# Altium schematic sheet [06]J-Link OB Debugger.SchDoc
size A4; Organization: Altium Limited; Address1: L3, 12a Rodborough Rd; Address2: Frenchs Forest; Address3: NSW; Address4: Australia 2086
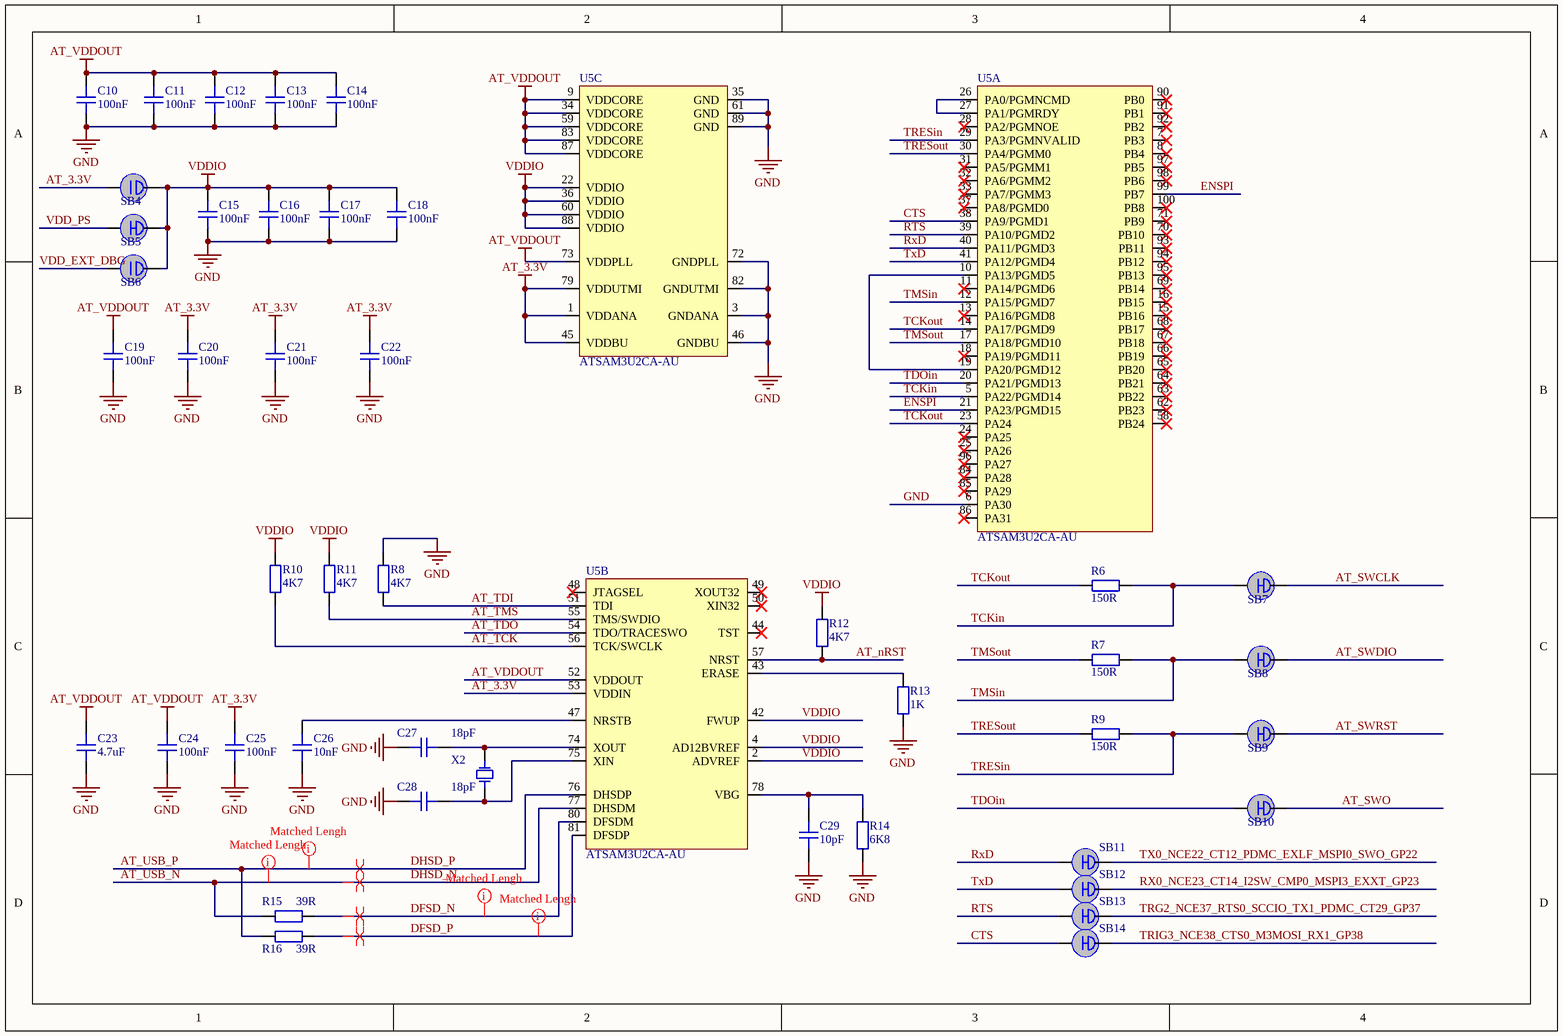
[diagram p0: [06]J-Link OB Debugger.SchDoc]

## Parts
C10  100nF  [CAPC1005L]
C11  100nF  [CAPC1005L]
C12  100nF  [CAPC1005L]
C13  100nF  [CAPC1005L]
C14  100nF  [CAPC1005L]
C15  100nF  [CAPC1005L]
C16  100nF  [CAPC1005L]
C17  100nF  [CAPC1005L]
C18  100nF  [CAPC1005L]
C19  100nF  [CAPC1005L]
C20  100nF  [CAPC1005L]
C21  100nF  [CAPC1005L]
C22  100nF  [CAPC1005L]
C23  4.7uF  [CAPC1005L]
C24  100nF  [CAPC1005L]
C25  100nF  [CAPC1005L]
C26  10nF  [CAPC1005L]
C27  18pF  [CAPC1005L]
C28  18pF  [CAPC1005L]
C29  10pF  [CAPC1005L]
R6  150R  [RESC1005L]
R7  150R  [RESC1005L]
R8  4K7  [RESC1005L]
R9  150R  [RESC1005L]
R10  4K7  [RESC1005L]
R11  4K7  [RESC1005L]
R12  4K7  [RESC1005L]
R13  1K  [RESC1005L]
R14  6K8  [RESC1005L]
R15  39R  [RESC1005L]
R16  39R  [RESC1005L]
SB4  SBO  [SBO]  (value not drawn)  (no BOM)
SB5  SBS  [SBS]  (value not drawn)  (net tie, no BOM)
SB6  SBO  [SBO]  (value not drawn)  (no BOM)
SB7  SBS  [SBS]  (value not drawn)  (net tie, no BOM)
SB8  SBS  [SBS]  (value not drawn)  (net tie, no BOM)
SB9  SBS  [SBS]  (value not drawn)  (net tie, no BOM)
SB10  SBS  [SBS]  (value not drawn)  (net tie, no BOM)
SB11  SBS  [SBS]  (value not drawn)  (net tie, no BOM)
SB12  SBS  [SBS]  (value not drawn)  (net tie, no BOM)
SB13  SBS  [SBS]  (value not drawn)  (net tie, no BOM)
SB14  SBS  [SBS]  (value not drawn)  (net tie, no BOM)
U5  ATSAM3U2CA-AU  [SQFP50P1600X1600-100L]  (parts A,B,C of 3)
X2  7M-12.000MAAJ-T  [OSCCC250X320X100L]  (value not drawn)

## Nets
AT_3.3V: C20.2 C21.2 C22.2 C25.2 SB4.1 U5.1(VDDANA) U5.45(VDDBU) U5.53(VDDIN) U5.79(VDDUTMI)
AT_VDDOUT: C10.2 C11.2 C12.2 C13.2 C14.2 C19.2 C23.2 C24.2 U5.9(VDDCORE) U5.34(VDDCORE) U5.52(VDDOUT) U5.59(VDDCORE) U5.73(VDDPLL) U5.83(VDDCORE) U5.87(VDDCORE)
GND: C10.1 C11.1 C12.1 C13.1 C14.1 C15.1 C16.1 C17.1 C18.1 C19.1 C20.1 C21.1 C22.1 C23.1 C24.1 C25.1 C26.1 C27.2 C28.2 C29.1 R8.2 R13.1 R14.2 U5.3(GNDANA) U5.6(PA30) U5.35(GND) U5.46(GNDBU) U5.61(GND) U5.72(GNDPLL) U5.82(GNDUTMI) U5.89(GND) X2.2 X2.4
VDDIO: C15.2 C16.2 C17.2 C18.2 R10.2 R11.2 R12.1 SB4.2 SB5.2 SB6.2 U5.2(ADVREF) U5.4(AD12BVREF) U5.22(VDDIO) U5.36(VDDIO) U5.42(FWUP) U5.60(VDDIO) U5.88(VDDIO)
AT_nRST: R12.2 U5.57(NRST)
AT_SWCLK: SB7.2
AT_SWDIO: SB8.2
AT_SWO: SB10.2
AT_SWRST: SB9.2
AT_TCK: R10.1 U5.56(TCK/SWCLK)
AT_TDI: R8.1 U5.51(TDI)
AT_TDO: U5.54(TDO/TRACESWO)
AT_TMS: R11.1 U5.55(TMS/SWDIO)
AT_USB_N: R15.2 U5.77(DHSDM)  [also labelled DHSD_N]
AT_USB_P: R16.2 U5.76(DHSDP)  [also labelled DHSD_P]
CTS: SB14.1 U5.38(PA9/PGMD1)
DFSD_N: R15.1 U5.80(DFSDM)
DFSD_P: R16.1 U5.81(DFSDP)
ENSPI: U5.21(PA23/PGMD15) U5.99(PB7)
RTS: SB13.1 U5.39(PA10/PGMD2)
RX0_NCE23_CT14_I2SW_CMP0_MSPI3_EXXT_GP23: SB12.2
RxD: SB11.1 U5.40(PA11/PGMD3)
TCKin: R6.1 SB7.1 U5.5(PA22/PGMD14)
TCKout: R6.2 U5.14(PA17/PGMD9) U5.23(PA24)
TDOin: SB10.1 U5.20(PA21/PGMD13)
TMSin: R7.1 SB8.1 U5.12(PA15/PGMD7)
TMSout: R7.2 U5.17(PA18/PGMD10)
TRESin: R9.1 SB9.1 U5.29(PA3/PGMNVALID)
TRESout: R9.2 U5.30(PA4/PGMM0)
TRG2_NCE37_RTS0_SCCIO_TX1_PDMC_CT29_GP37: SB13.2
TRIG3_NCE38_CTS0_M3MOSI_RX1_GP38: SB14.2
TX0_NCE22_CT12_PDMC_EXLF_MSPI0_SWO_GP22: SB11.2
TxD: SB12.1 U5.41(PA12/PGMD4)
VDD_EXT_DBG: SB6.1
VDD_PS: SB5.1
NetC26_2: C26.2 U5.47(NRSTB)
NetC27_1: C27.1 U5.74(XOUT) X2.3
NetC28_1: C28.1 U5.75(XIN) X2.1
NetC29_2: C29.2 R14.1 U5.78(VBG)
NetR13_2: R13.2 U5.43(ERASE)
NetU5_10: U5.10(PA13/PGMD5) U5.19(PA20/PGMD12)
NetU5_26: U5.26(PA0/PGMNCMD) U5.27(PA1/PGMRDY)

Not connected (* = marked no-connect by the designer): U5 7(PB3)* 8(PB4)* 11(PA14/PGMD6)* 13(PA16/PGMD8)* 15(PB16)* 16(PB15)* 18(PA19/PGMD11)* 24(PA25)* 25(PA26)* 28(PA2/PGMNOE)* 31(PA5/PGMM1)* 32(PA6/PGMM2)* 33(PA7/PGMM3)* 37(PA8/PGMD0)* 44(TST)* 48(JTAGSEL)* 49(XOUT32)* 50(XIN32)* 58(PB24)* 62(PB23)* 63(PB22)* 64(PB21)* 65(PB20)* 66(PB19)* 67(PB18)* 68(PB17)* 69(PB14)* 70(PB10)* 71(PB9)* 84(PA28)* 85(PA29)* 86(PA31)* 90(PB0)* 91(PB1)* 92(PB2)* 93(PB11)* 94(PB12)* 95(PB13)* 96(PA27)* 97(PB5)* 98(PB6)* 100(PB8)*

## Layout directives
differential pair: AT_USB_N, AT_USB_P, DFSD_N, DFSD_P
rule Matched Net Lengths [Tolerance = 50mil]: AT_USB_N, AT_USB_P, DFSD_N, DFSD_P

## Notes on the sheet
- Title
- Size:
- Date:
- A3
- Number:
- Time:
- Revision:
- Sheet
- of
- File:

## Library data of the parts
C10-C29 = CAP_CHP: Surface Mount Unpolarized Capacitor
R6-R16 = RES_CHP: Surface Mount Resistor
SB4 SB6 = SBO: Open-circuit soldering bridge
SB5 SB7-SB14 = SBS: Short-circuit soldering bridge
U5 = ATSAM3U2CA: Atmel | SMART ARM-based Flash MCU
X2 = XTAL_SMD_4PIN: XTAL 12MHz ±30ppm 18pF 100 Ohm -20°C ~ 70°C SMD 3225